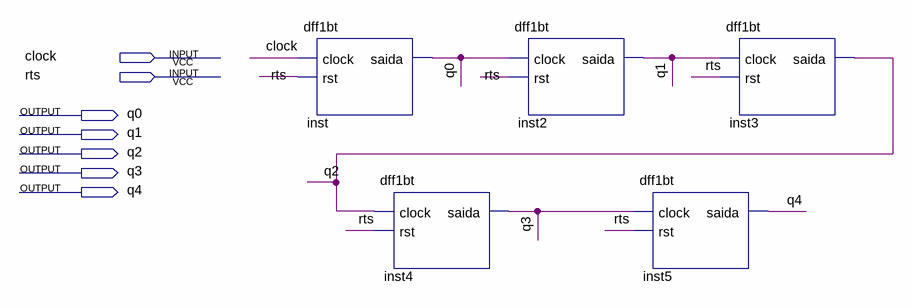
[diagram p0: schematic sheet]
// Quartus schematic dff5bt.bdf as structural Verilog: 5 symbols, 7 pins
module dff5bt (
  input  clock,
  input  rts,
  output q0,
  output q1,
  output q2,
  output q3,
  output q4
);

  dff1bt inst (.clock(clock), .rst(rts), .saida(q0));
  dff1bt inst4 (.clock(q2), .rst(rts), .saida(q3));
  dff1bt inst2 (.clock(q0), .rst(rts), .saida(q1));
  dff1bt inst5 (.clock(q3), .rst(rts), .saida(q4));
  dff1bt inst3 (.clock(q1), .rst(rts), .saida(q2));
endmodule
